# Altium schematic sheet Buttons.SchDoc
size A4
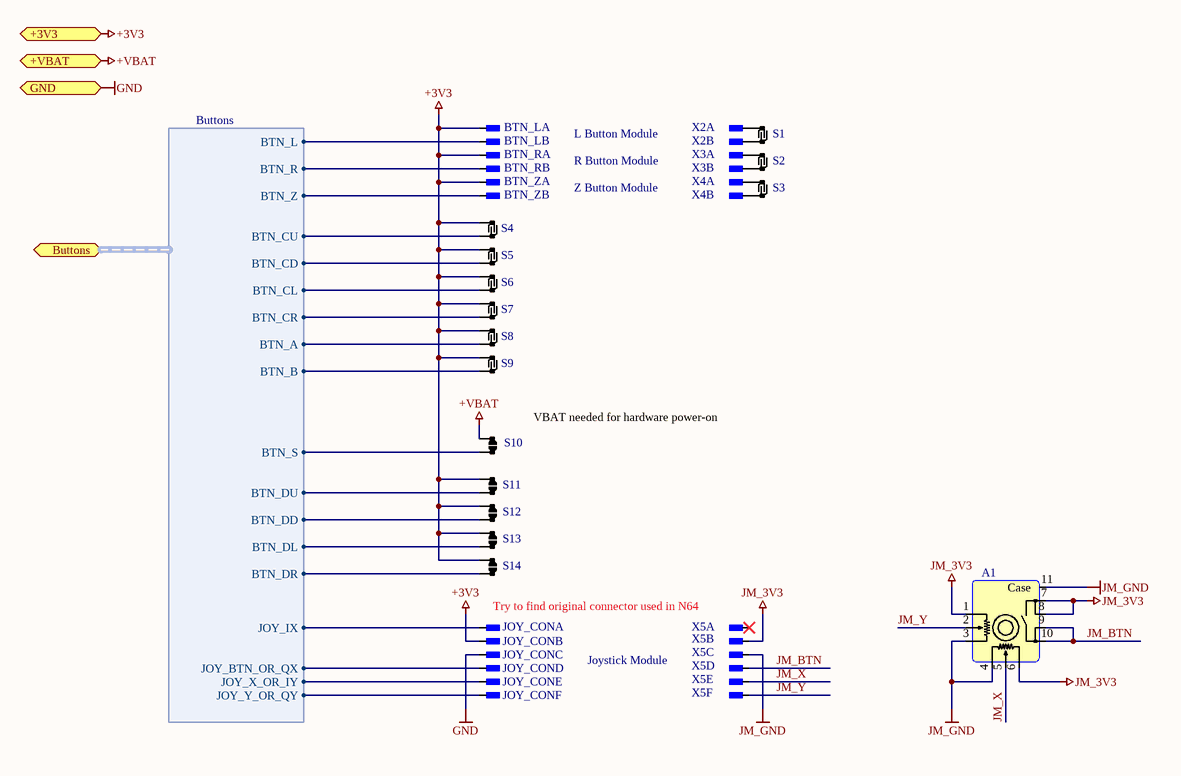
[diagram p0: Buttons.SchDoc]

## Parts
A1  A_JOYSTICK_MODULE_RKJXK122400Y  [A_JOYSTICK_MODULE_RKJXK122400Y]  (value not drawn)
BTN_L  X_CONNECTOR_P2.54_D0.9_1X2  [THT_CON_P2.54_D0.9_1X2]  (value not drawn)  (parts A,B of 2)
BTN_R  X_CONNECTOR_P2.54_D0.9_1X2  [THT_CON_P2.54_D0.9_1X2]  (value not drawn)  (parts A,B of 2)
BTN_Z  X_CONNECTOR_P2.54_D0.9_1X2  [THT_CON_P2.54_D0.9_1X2]  (value not drawn)  (parts A,B of 2)
JOY_CON  X_CONNECTOR_P2.54_D0.9_1X6  [THT_CON_P2.54_D0.9_1X6]  (value not drawn)  (parts A,B,C,D,E,F of 6)
S1  S_N64_FINGER_CARBON_CONTACT  [SMD_N64_FINGER_CARBON_CONTACT]  (value not drawn)
S2  S_N64_FINGER_CARBON_CONTACT  [SMD_N64_FINGER_CARBON_CONTACT]  (value not drawn)
S3  S_N64_FINGER_CARBON_CONTACT  [SMD_N64_FINGER_CARBON_CONTACT]  (value not drawn)
S4  S_N64_FINGER_CARBON_CONTACT  [SMD_N64_FINGER_CARBON_CONTACT]  (value not drawn)
S5  S_N64_FINGER_CARBON_CONTACT  [SMD_N64_FINGER_CARBON_CONTACT]  (value not drawn)
S6  S_N64_FINGER_CARBON_CONTACT  [SMD_N64_FINGER_CARBON_CONTACT]  (value not drawn)
S7  S_N64_FINGER_CARBON_CONTACT  [SMD_N64_FINGER_CARBON_CONTACT]  (value not drawn)
S8  S_N64_FINGER_CARBON_CONTACT  [SMD_N64_FINGER_CARBON_CONTACT]  (value not drawn)
S9  S_N64_FINGER_CARBON_CONTACT  [SMD_N64_FINGER_CARBON_CONTACT]  (value not drawn)
S10  S_N64_START_CARBON_CONTACT  [SMD_N64_START_CARBON_CONTACT]  (value not drawn)
S11  S_N64_DPAD_CARBON_CONTACT  [SMD_N64_DPAD_CARBON_CONTACT]  (value not drawn)
S12  S_N64_DPAD_CARBON_CONTACT  [SMD_N64_DPAD_CARBON_CONTACT]  (value not drawn)
S13  S_N64_DPAD_CARBON_CONTACT  [SMD_N64_DPAD_CARBON_CONTACT]  (value not drawn)
S14  S_N64_DPAD_CARBON_CONTACT  [SMD_N64_DPAD_CARBON_CONTACT]  (value not drawn)
X2  X_CONNECTOR_P2.54_D0.9_1X2  [THT_CON_P2.54_D0.9_1X2]  (value not drawn)  (parts A,B of 2)
X3  X_CONNECTOR_P2.54_D0.9_1X2  [THT_CON_P2.54_D0.9_1X2]  (value not drawn)  (parts A,B of 2)
X4  X_CONNECTOR_P2.54_D0.9_1X2  [THT_CON_P2.54_D0.9_1X2]  (value not drawn)  (parts A,B of 2)
X5  X_CONNECTOR_P2.54_D0.9_2X3  [THT_CON_P2.54_D0.9_2X3]  (value not drawn)  (parts A,B,C,D,E,F of 6)

## Ports
+3V3, +VBAT, Buttons (harness Buttons), GND

## Harnesses
Buttons: BTN_A, BTN_B, BTN_CD, BTN_CL, BTN_CR, BTN_CU, BTN_DD, BTN_DL, BTN_DR, BTN_DU, JOY_Y_OR_QY, BTN_L, BTN_R, BTN_S, BTN_Z, JOY_IX, JOY_BTN_OR_QX, JOY_X_OR_IY

## Nets
+3V3: BTN_L.1 BTN_R.1 BTN_Z.1 JOY_CON.2 S4.1 S5.1 S6.1 S7.1 S8.1 S9.1 S11.1 S12.1 S13.1 S14.1 ; port +3V3
+VBAT: S10.1 ; port +VBAT
GND: JOY_CON.3 ; port GND
JM_3V3: A1.1(XV+) A1.6(YV-) A1.7(BTN+) A1.8(BTN+) X5.2
JM_GND: A1.3(XV-) A1.4(YV+) A1.11(Case) X5.3
JM_BTN: A1.9(BTN-) A1.10(BTN-) X5.4
JM_X: A1.5(Y) X5.5
JM_Y: A1.2(X) X5.6
NetBTN_L_2: BTN_L.2 ; port Buttons.BTN_L
NetBTN_R_2: BTN_R.2 ; port Buttons.BTN_R
NetBTN_Z_2: BTN_Z.2 ; port Buttons.BTN_Z
NetJOY_CON_1: JOY_CON.1 ; port Buttons.JOY_IX
NetJOY_CON_4: JOY_CON.4 ; port Buttons.JOY_BTN_OR_QX
NetJOY_CON_5: JOY_CON.5 ; port Buttons.JOY_X_OR_IY
NetJOY_CON_6: JOY_CON.6 ; port Buttons.JOY_Y_OR_QY
NetS1_1: S1.1 X2.1
NetS1_2: S1.2 X2.2
NetS2_1: S2.1 X3.1
NetS2_2: S2.2 X3.2
NetS3_1: S3.1 X4.1
NetS3_2: S3.2 X4.2
NetS4_2: S4.2 ; port Buttons.BTN_CU
NetS5_2: S5.2 ; port Buttons.BTN_CD
NetS6_2: S6.2 ; port Buttons.BTN_CL
NetS7_2: S7.2 ; port Buttons.BTN_CR
NetS8_2: S8.2 ; port Buttons.BTN_A
NetS9_2: S9.2 ; port Buttons.BTN_B
NetS10_2: S10.2 ; port Buttons.BTN_S
NetS11_2: S11.2 ; port Buttons.BTN_DU
NetS12_2: S12.2 ; port Buttons.BTN_DD
NetS13_2: S13.2 ; port Buttons.BTN_DL
NetS14_2: S14.2 ; port Buttons.BTN_DR

Not connected (* = marked no-connect by the designer): X5 1*

## Notes on the sheet
- L Button Module
- R Button Module
- Z Button Module
- VBAT needed for hardware power-on
- Try to find original connector used in N64
- Joystick Module
- Title
- Size:
- Date:
- A4
- Number:
- Time:
- Revision:
- Sheet
- of
- File:

## Library data of the parts
BTN_L BTN_R BTN_Z X2-X4 = X_CONNECTOR_P2.54_D0.9_1X2: Pitch 2.54, Diameter 0.9mm, 1 row, 2 columns; Type: Pitch 2.54, Diameter 0.9mm, 1 row, 2 columns
JOY_CON = X_CONNECTOR_P2.54_D0.9_1X6: Pitch 2.54, Diameter 0.9mm, 1 row, 6 columns; Type: Pitch 2.54, Diameter 0.9mm, 1 row, 3 columns
S1-S9 = S_N64_FINGER_CARBON_CONTACT: N64 DPAD Carbon ink contact
S10 = S_N64_START_CARBON_CONTACT: N64 DPAD Carbon ink contact
S11-S14 = S_N64_DPAD_CARBON_CONTACT: N64 DPAD Carbon ink contact
X5 = X_CONNECTOR_P2.54_D0.9_2X3: Pitch 2.54, Diameter 0.9mm, 2 row, 3 columns; Type: Pitch 2.54, Diameter 0.9mm, 2 row, 3 columns
A1 = A_JOYSTICK_MODULE_RKJXK122400Y: Type: RKJXK122400Y